# Altium project Base.PrjPCB
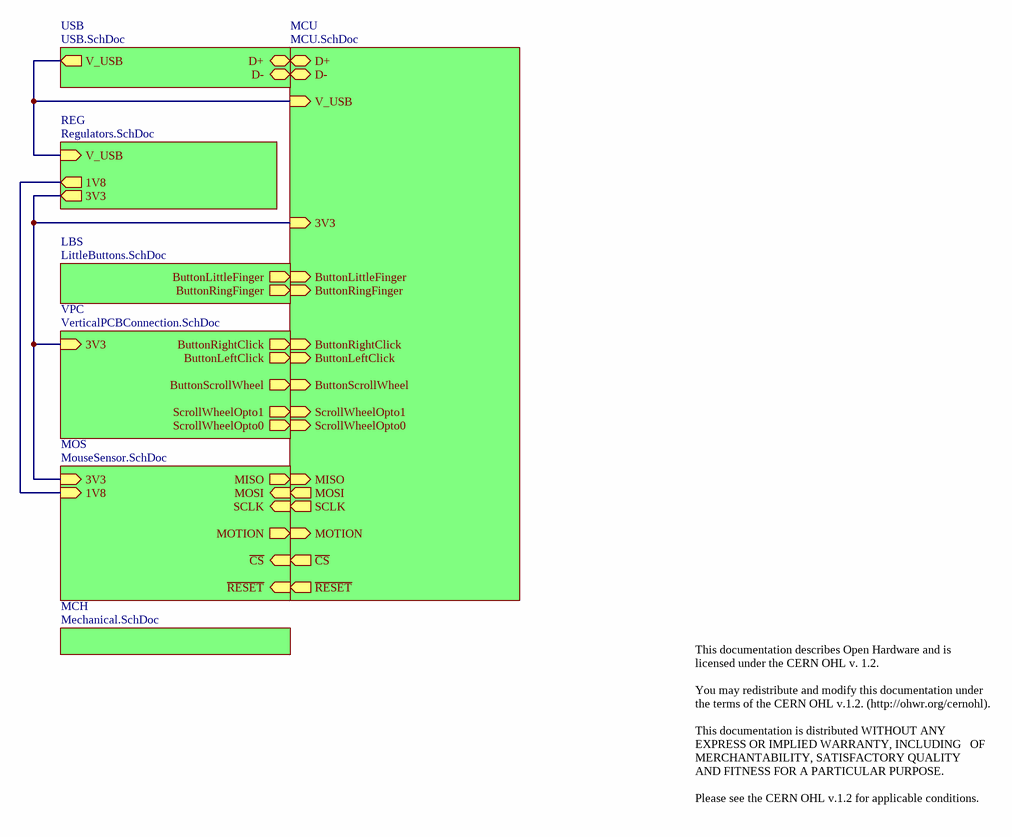
[diagram p0: Base.SchDoc]
8 sheets, 95 parts. Net scope: hierarchical (ports join the sheet entries above them; power ports are global).
Board file: Base.PcbDoc
Sheets:
  Base.SchDoc
    MCU = MCU.SchDoc
    MCH = Mechanical.SchDoc
    REG = Regulators.SchDoc
    VPC = VerticalPCBConnection.SchDoc
    MOS = MouseSensor.SchDoc
    USB = USB.SchDoc
    LBS = LittleButtons.SchDoc

## Sheet Base.SchDoc
size Letter; CompanyName: PloopyCo; Organization: Ploopy Co; Address1: 137-1140 Burnhamthorpe Road W; Address2: Mississauga; Address3: Ontario; Address4: Canada L5C 0A3; DocumentNumber: 1; Revision: R1.004; SheetNumber: 1; SheetTotal: 8

### Sub-sheets
LBS = LittleButtons.SchDoc: ButtonLittleFinger (out), ButtonRingFinger (out)
MCH = Mechanical.SchDoc: no entries
MCU = MCU.SchDoc: 3V3 (in), D+ (bidir), D- (bidir), ButtonRightClick (in), ButtonLeftClick (in), ScrollWheelOpto1 (in), ScrollWheelOpto0 (in), ButtonScrollWheel (in), ButtonLittleFinger (in), ButtonRingFinger (in), ~{CS} (out), MISO (in), MOSI (out), SCLK (out), V_USB (in), ~{RESET} (out), MOTION (in)
MOS = MouseSensor.SchDoc: 1V8 (in), 3V3 (in), ~{CS} (in), MISO (out), MOSI (in), SCLK (in), ~{RESET} (in), MOTION (out)
REG = Regulators.SchDoc: 3V3 (out), V_USB (in), 1V8 (out)
USB = USB.SchDoc: D+ (bidir), V_USB (out), D- (bidir)
VPC = VerticalPCBConnection.SchDoc: 3V3 (in), ButtonRightClick (out), ButtonLeftClick (out), ScrollWheelOpto1 (out), ScrollWheelOpto0 (out), ButtonScrollWheel (out)

### Nets
1V8: sheet REG/1V8, sheet MOS/1V8
3V3: sheet MCU/3V3, sheet REG/3V3, sheet VPC/3V3, sheet MOS/3V3
~{CS}: sheet MCU/~{CS}, sheet MOS/~{CS}
MISO: sheet MCU/MISO, sheet MOS/MISO
MOSI: sheet MCU/MOSI, sheet MOS/MOSI
~{RESET}: sheet MCU/~{RESET}, sheet MOS/~{RESET}
SCLK: sheet MCU/SCLK, sheet MOS/SCLK
V_USB: sheet MCU/V_USB, sheet REG/V_USB, sheet USB/V_USB
NetC20_2: sheet MCU/ButtonRingFinger, sheet LBS/ButtonRingFinger
NetC21_2: sheet MCU/ButtonLittleFinger, sheet LBS/ButtonLittleFinger
NetCJ3_1: sheet MCU/ScrollWheelOpto0, sheet VPC/ScrollWheelOpto0
NetCJ4_1: sheet MCU/ScrollWheelOpto1, sheet VPC/ScrollWheelOpto1
NetR6_2: sheet MCU/D-, sheet USB/D-
NetR7_2: sheet MCU/D+, sheet USB/D+
NetR8_2: sheet MCU/ButtonScrollWheel, sheet VPC/ButtonScrollWheel
NetR9_2: sheet MCU/ButtonLeftClick, sheet VPC/ButtonLeftClick
NetR10_2: sheet MCU/ButtonRightClick, sheet VPC/ButtonRightClick
NetU1_19: sheet MCU/MOTION, sheet MOS/MOTION

### Notes on the sheet
- This documentation describes Open Hardware and is licensed under the CERN OHL v. 1.2.
  You may redistribute and modify this documentation under the terms of the CERN OHL v.1.2. (http://ohwr.org/cernohl).
  This documentation is distributed WITHOUT ANY EXPRESS OR IMPLIED WARRANTY, INCLUDING   OF MERCHANTABILITY, SATISFACTORY QUALITY   AND FITNESS FOR A PARTICULAR PURPOSE.
  Please see the CERN OHL v.1.2 for applicable conditions.
- Copyright Ploopy Corporation 2019
- Licensed under the CERN OHL v. 1.2
- http://ohwr.org/cernohl
- Title:
- PCB:
- Version:
- Ploopy Corporation
- Mississauga ON L5C 0A3
- 137-1140 Burnhamthorpe Road W
- Date:
- Time:
- Sheet
- of
- Canada

## Sheet MCU.SchDoc
size Legal; CompanyName: PloopyCo; Organization: Ploopy Co; Address1: 137-1140 Burnhamthorpe Road W; Address2: Mississauga; Address3: Ontario; Address4: Canada L5C 0A3; DocumentNumber: 3; Revision: R1.004; SheetNumber: 3; SheetTotal: 8
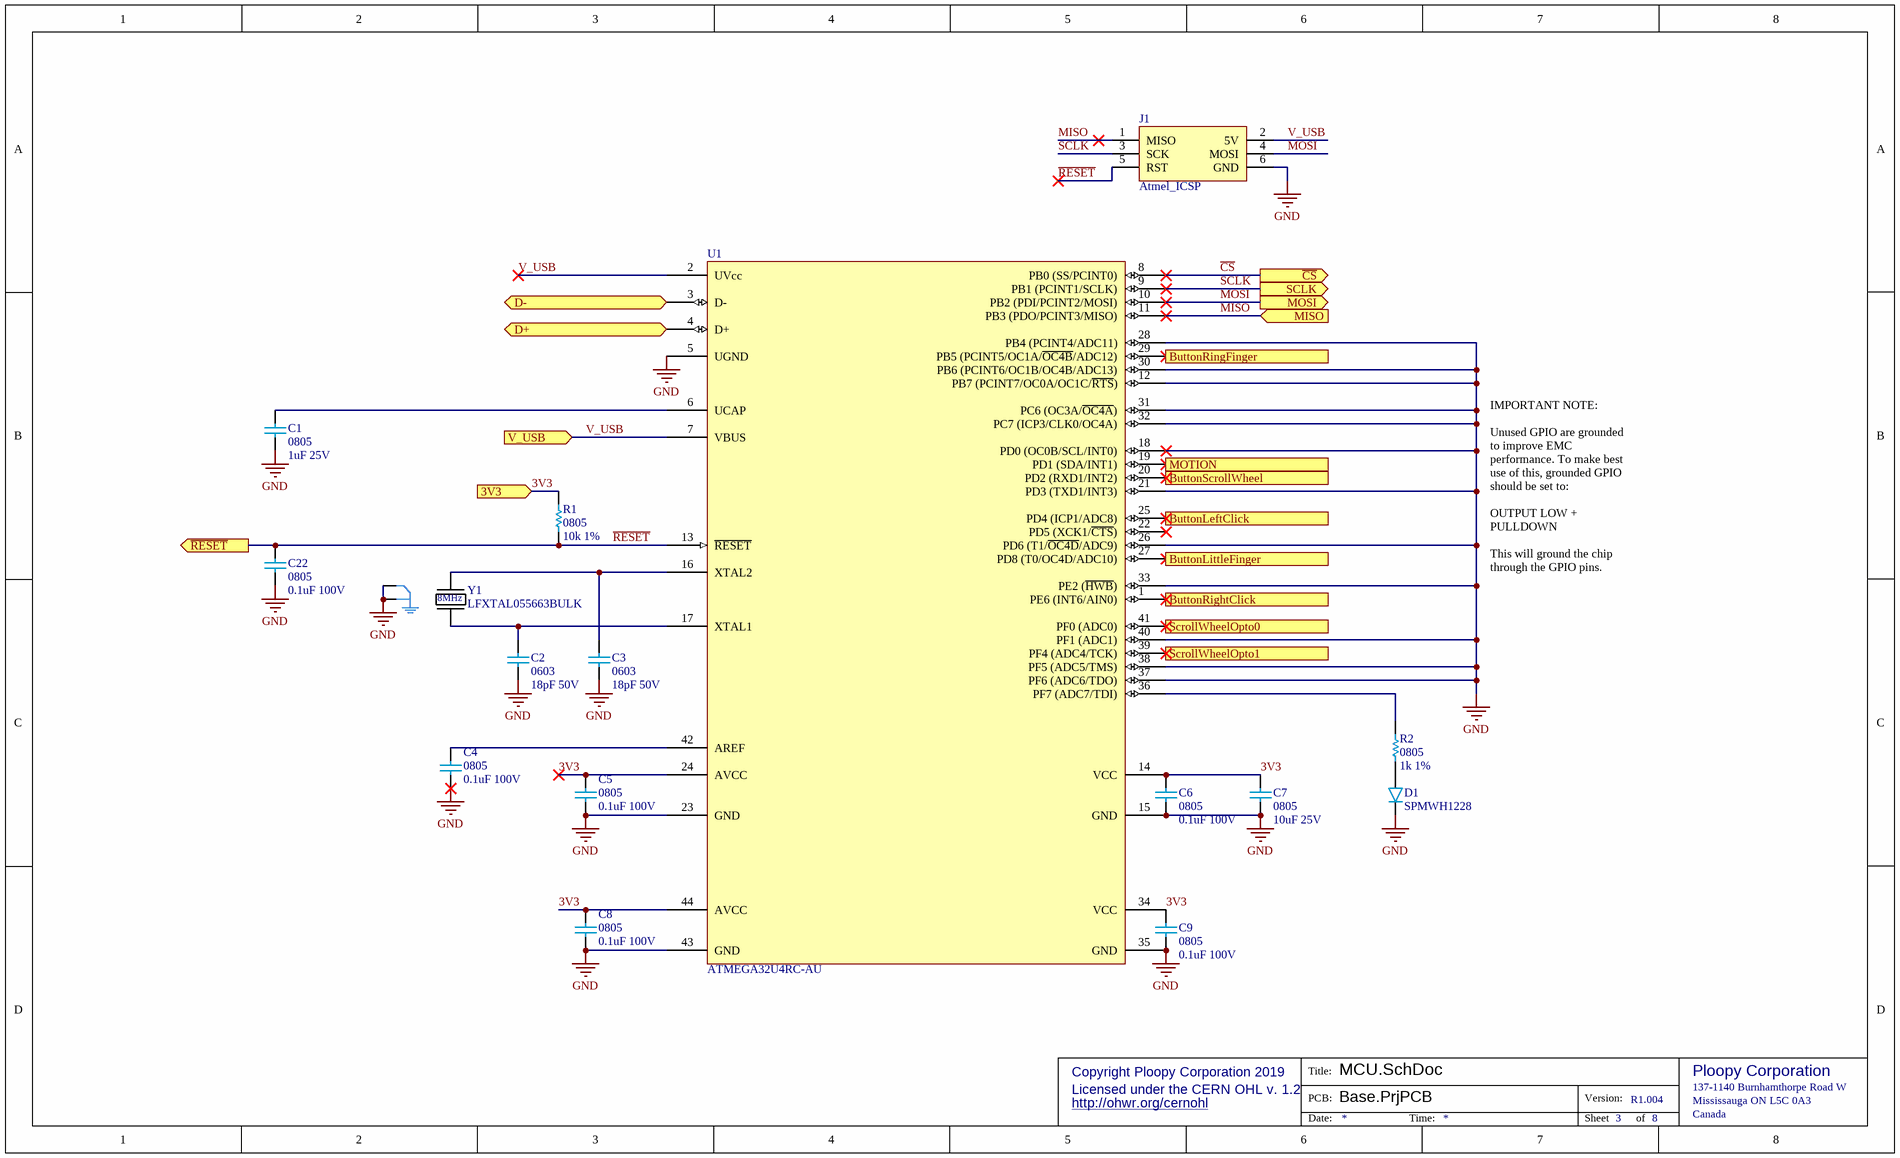
[diagram p1: MCU.SchDoc]

### Parts
C1  0805  value 1uF 25V  [0805]
C2  0603  value 18pF 50V  [0603]
C3  0603  value 18pF 50V  [0603]
C4  0805  value 0.1uF 100V  [0805]
C5  0805  value 0.1uF 100V  [0805]
C6  0805  value 0.1uF 100V  [0805]
C7  0805  value 10uF 25V  [0805]
C8  0805  value 0.1uF 100V  [0805]
C9  0805  value 0.1uF 100V  [0805]
C22  0805  value 0.1uF 100V  [0805]
D1  SPMWH1228  [SPMWH1228]
J1  Atmel_ICSP  [6x2]
R1  0805  value 10k 1%  [0805]
R2  0805  value 1k 1%  [0805]
U1  ATMEGA32U4RC-AU  [ATmega32U4 - TQFP80P1200X1200X120-44N]
Y1  LFXTAL055663BULK  [LFXTAL055663BULK]

### Ports
3V3 (in), ButtonLeftClick (in), ButtonLittleFinger (in), ButtonRightClick (in), ButtonRingFinger (in), ButtonScrollWheel (in), D+ (bidir), D- (bidir), MISO (in), MOSI (out), MOTION (in), SCLK (out), ScrollWheelOpto0 (in), ScrollWheelOpto1 (in), V_USB (in), ~{CS} (out), ~{RESET} (out)

### Nets
GND: C1.1 C2.1 C3.1 C4.1 C5.1 C6.1 C7.1 C8.1 C9.1 C22.1 D1.2(C) J1.6(GND) U1.5(UGND) U1.12(PB7_(PCINT7/OC0A/OC1C/~{RTS})) U1.15(GND) U1.18(PD0_(OC0B/SCL/INT0)) U1.21(PD3_(TXD1/INT3)) U1.23(GND) U1.26(PD6_(T1/~{OC4D}/ADC9)) U1.28(PB4_(PCINT4/ADC11)) U1.30(PB6_(PCINT6/OC1B/OC4B/ADC13)) U1.31(PC6_(OC3A/~{OC4A})) U1.32(PC7_(ICP3/CLK0/OC4A)) U1.33(PE2_(~{HWB})) U1.35(GND) U1.37(PF6_(ADC6/TDO)) U1.38(PF5_(ADC5/TMS)) U1.40(PF1_(ADC1)) U1.43(GND) Y1.2 Y1.4
3V3: C5.2 C6.2 C7.2 C8.2 C9.2 R1.2 U1.14(VCC) U1.24(AVCC) U1.34(VCC) U1.44(AVCC) ; port 3V3
~{CS}: U1.8(PB0_(SS/PCINT0)) ; port ~{CS}
MISO: J1.1(MISO) U1.11(PB3_(PDO/PCINT3/MISO)) ; port MISO
MOSI: J1.4(MOSI) U1.10(PB2_(PDI/PCINT2/MOSI)) ; port MOSI
~{RESET}: C22.2 J1.5(RST) R1.1 U1.13(~{RESET}) ; port ~{RESET}
SCLK: J1.3(SCK) U1.9(PB1_(PCINT1/SCLK)) ; port SCLK
V_USB: J1.2(5V) U1.2(UVcc) U1.7(VBUS) ; port V_USB
NetC1_2: C1.2 U1.6(UCAP)
NetC2_2: C2.2 U1.17(XTAL1) Y1.3
NetC3_2: C3.2 U1.16(XTAL2) Y1.1
NetC4_2: C4.2 U1.42(AREF)
NetC20_2: U1.29(PB5_(PCINT5/OC1A/~{OC4B}/ADC12)) ; port ButtonRingFinger
NetC21_2: U1.27(PD8_(T0/OC4D/ADC10)) ; port ButtonLittleFinger
NetCJ3_1: U1.41(PF0_(ADC0)) ; port ScrollWheelOpto0
NetCJ4_1: U1.39(PF4_(ADC4/TCK)) ; port ScrollWheelOpto1
NetD1_1: D1.1(A) R2.1
NetR2_2: R2.2 U1.36(PF7_(ADC7/TDI))
NetR6_2: U1.3(D-) ; port D-
NetR7_2: U1.4(D+) ; port D+
NetR8_2: U1.20(PD2_(RXD1/INT2)) ; port ButtonScrollWheel
NetR9_2: U1.25(PD4_(ICP1/ADC8)) ; port ButtonLeftClick
NetR10_2: U1.1(PE6_(INT6/AIN0)) ; port ButtonRightClick
NetU1_19: U1.19(PD1_(SDA/INT1)) ; port MOTION

Not connected (* = marked no-connect by the designer): U1 22(PD5_(XCK1/~{CTS}))*

### Notes on the sheet
- IMPORTANT NOTE:
  Unused GPIO are grounded to improve EMC performance. To make best use of this, grounded GPIO should be set to:
  OUTPUT LOW + PULLDOWN
  This will ground the chip through the GPIO pins.
- Copyright Ploopy Corporation 2019
- Licensed under the CERN OHL v. 1.2
- http://ohwr.org/cernohl
- Title:
- PCB:
- Version:
- Ploopy Corporation
- Mississauga ON L5C 0A3
- 137-1140 Burnhamthorpe Road W
- Date:
- Time:
- Sheet
- of
- Canada
- (in symbol LFXTAL055663BULK) 8MHz

### Library data of the parts
C1 = Cap 1uF 25V: 0805, X5R or better; PNP-Nzl: 2; PNP-dx: 0; PNP-Level: 1; PNP-Thk: 1.25; PNP-TS: 70; PNP-Type: chi; PNP-X: 2.00; PNP-FeedType: Tape; PNP-TapeWidth: 8; Supplier 1: Digi-Key; Supplier Part Number 1: 1276-1066-2-ND; Supplier 2: Digi-Key; Supplier Part Number 2: 1276-1066-1-ND; PNP-dy: 0; PNP-Lv: 1; PNP-Pt: 0; PNP-Voff: 0; PNP-W: 0; PNP-Y: 1.25; PNP-A: 0; PNP-PlacePriority: 1; PNP-TapeIndex: 1; PNP-da: 0
C2 C3 = Cap 18pF 50V: 0603, C0G or better; PNP-Nzl: 2; PNP-dx: 0; PNP-X: 2.00; PNP-Y: 1.25; PNP-Thk: 0.60; PNP-Lv: 1; PNP-TS: 70; PNP-Type: chi; PNP-FeedType: Tape; PNP-TapeWidth: 8; PNP-dy: 0; PNP-Pt: 0; PNP-W: 0; PNP-Level: 1; PNP-Voff: 0; PNP-PlacePriority: 1; PNP-A: 0; PNP-TapeIndex: 1; PNP-da: 0; Supplier 1: Digi-Key; Supplier Part Number 1: 1292-1494-1-ND
C4-C6 C8 C9 = Cap 0.1uF 100V: 0805, X5R or better; PNP-Nzl: 2; PNP-dx: 0; PNP-Level: 1; PNP-Thk: 1.05; PNP-TS: 70; PNP-Type: chi; PNP-X: 2.00; PNP-Y: 1.25; PNP-FeedType: Tape; PNP-TapeWidth: 8; Supplier 1: Digi-Key; Supplier Part Number 1: 1276-6840-2-ND; PNP-dy: 0; PNP-Lv: 1; PNP-Pt: 0; PNP-Voff: 0; PNP-W: 0; PNP-A: 0; PNP-PlacePriority: 1; PNP-TapeIndex: 1; PNP-da: 0
C7 = Cap 10uF 25V: 0805, X5R or better; PNP-Nzl: 2; PNP-dx: 0; PNP-X: 2.00; PNP-Y: 1.25; PNP-Lv: 1; PNP-TS: 70; PNP-Type: chi; PNP-FeedType: Tape; PNP-TapeWidth: 8; PNP-dy: 0; PNP-Pt: 0; PNP-W: 0; PNP-Thk: 1.25; PNP-Level: 1; PNP-Voff: 0; PNP-PlacePriority: 1; PNP-A: 0; PNP-TapeIndex: 1; Supplier 1: Mouser; Supplier Part Number 1: 81-GRM21BR61E106KA3L; Supplier 2: Digi-Key; Supplier Part Number 2: 490-5523-1-ND; PNP-da: 0
C22 = Cap 0.1uF 100V: 0805, X5R or better; PNP-Nzl: 2; PNP-dx: 0; PNP-X: 2.00; PNP-Y: 1.25; PNP-Thk: 1.05; PNP-Lv: 1; PNP-TS: 70; PNP-Type: chi; PNP-FeedType: Tape; PNP-TapeWidth: 8; PNP-dy: 0; PNP-Pt: 0; PNP-W: 0; PNP-Level: 1; PNP-Voff: 0; PNP-PlacePriority: 1; PNP-A: 0; PNP-TapeIndex: 1; Supplier 1: Digi-Key; Supplier Part Number 1: 1276-6840-2-ND; PNP-da: 0
D1 = SPMWH1228: 3V/0.5W white LED, 2.8mm x 3.5mm; PNP-Nzl: 3; PNP-dx: 0; PNP-X: 2.8; PNP-Y: 3.2; PNP-A: 90; PNP-Thk: 0.65; PNP-Lv: 1; PNP-TS: 70; PNP-Type: chi; PNP-FeedType: Tape; PNP-TapeWidth: 8; PNP-PlacePriority: 2; PNP-da: 550; PNP-dy: 0; PNP-Pt: 0; PNP-W: 0; PNP-Level: 1; PNP-Voff: 0; PNP-TapeIndex: 1; Supplier 2: Digi-Key; Supplier Part Number 2: 1510-1428-1-ND; Supplier 3: Digi-Key; Supplier Part Number 3: 1510-1429-1-ND; Supplier 1: Arrow
J1 = Atmel_ICSP: 6-pin 0.100" ICSP header; PNP-da: 0; Supplier 1: Digi-Key; Supplier Part Number 1: S2012EC-03-ND
R1 = Res 10k 1% 0805: Chip resistor; PNP-Nzl: 2; PNP-dx: 0; PNP-X: 2.00; PNP-Y: 1.25; PNP-Thk: 0.55; PNP-Lv: 1; PNP-TS: 70; PNP-Type: chi; PNP-FeedType: Tape; PNP-TapeWidth: 8; Supplier 1: Digi-Key; Supplier Part Number 1: RMCF0805FT10K0TR-ND; PNP-dy: 0; PNP-Pt: 0; PNP-W: 0; PNP-Level: 1; PNP-Voff: 0; PNP-PlacePriority: 1; PNP-A: 0; PNP-TapeIndex: 1; PNP-da: 0
R2 = Res 1k 1% 0805: Chip resistor, 1/8W 100PPM; PNP-Nzl: 2; PNP-dx: 0; PNP-X: 2.00; PNP-Y: 1.25; PNP-Thk: 0.55; PNP-Lv: 1; PNP-TS: 70; PNP-Type: chi; PNP-FeedType: Tape; PNP-TapeWidth: 8; Supplier 1: Digi-Key; Supplier Part Number 1: RMCF0805FT1K00TR-ND; PNP-dy: 0; PNP-Pt: 0; PNP-W: 0; PNP-Level: 1; PNP-Voff: 0; PNP-PlacePriority: 1; PNP-A: 0; PNP-TapeIndex: 1; PNP-da: 0
U1 = ATMEGA32U4RC-AU: IC MCU 8BIT 32KB FLASH 44TQFP; PNP-Nzl: 6; PNP-dx: 0; PNP-X: 12; PNP-A: 270; PNP-Pt: 1; PNP-W: 0.1; PNP-Thk: 1.6; PNP-Lv: 126; PNP-TS: 70; PNP-Level: 1.2; PNP-Type: QFP; PNP-FeedType: Tray; PNP-PlacePriority: 3; PNP-dy: 0; PNP-Y: 12; PNP-Voff: 0; PNP-da: 0; Supplier 1: Digi-Key; Supplier 2: Mouser; Supplier 3: Arrow; Supplier Part Number 1: ATMEGA32U4RC-AU-ND; Supplier Part Number 2: 556-ATMEGA32U4RC-AU; Supplier Part Number 3: ATMEGA32U4RC-AU
Y1 = LFXTAL055663BULK: 8MHz ±20ppm Crystal 18pF 150 Ohms 4-SMD, No Lead; PNP-Nzl: 4; PNP-dx: 0; PNP-X: 8; PNP-Y: 4.5; PNP-Thk: 1.8; PNP-Lv: 1; PNP-TS: 70; PNP-Type: tr; PNP-FeedType: Tape; PNP-TapeWidth: 16; PNP-PlacePriority: 3; PNP-TapeIndex: 2; PNP-dy: 0; PNP-A: 0; PNP-Pt: 0; PNP-W: 0; PNP-Level: 1; PNP-Voff: 0; PNP-da: 0; Supplier 1: Digi-Key; Supplier 2: Mouser; Supplier Part Number 1: 1923-1256-ND; Supplier Part Number 2: 449-LFXTAL055663BULK

## Sheet Mechanical.SchDoc
size Letter; CompanyName: PloopyCo; Organization: Ploopy Co; Address1: 137-1140 Burnhamthorpe Road W; Address2: Mississauga; Address3: Ontario; Address4: Canada L5C 0A3; DocumentNumber: 4; Revision: R1.004; SheetNumber: 4; SheetTotal: 8
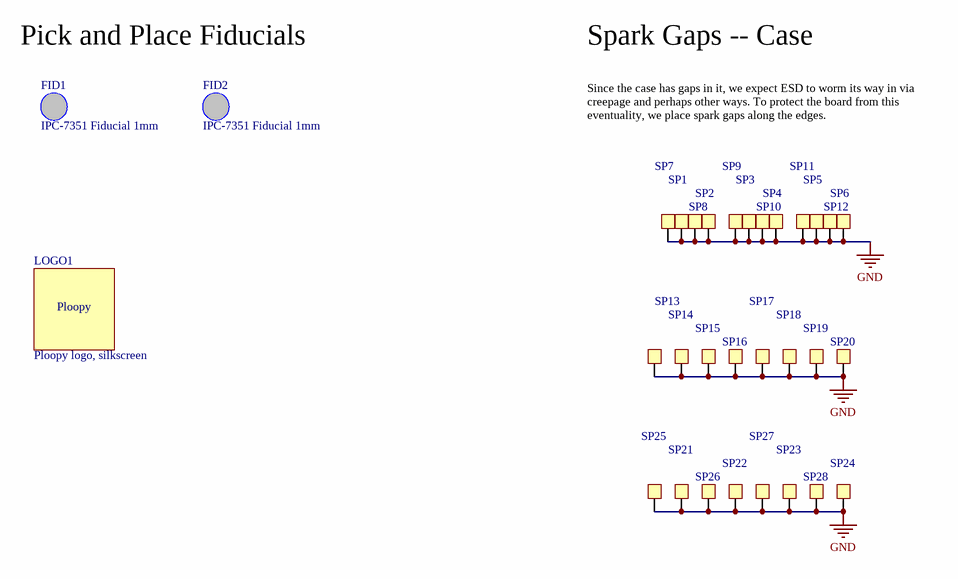
[diagram p2: Mechanical.SchDoc]

### Parts
FID1  IPC-7351 Fiducial 1mm  [FIDUCIAL_1.5]
FID2  IPC-7351 Fiducial 1mm  [FIDUCIAL_1.5]
LOGO1  Ploopy logo, silkscreen  [PloopyLogo]  (no BOM)
SP1  Spark Gap  [SparkGap]  (value not drawn)  (no BOM)
SP2  Spark Gap  [SparkGap]  (value not drawn)  (no BOM)
SP3  Spark Gap  [SparkGap]  (value not drawn)  (no BOM)
SP4  Spark Gap  [SparkGap]  (value not drawn)  (no BOM)
SP5  Spark Gap  [SparkGap]  (value not drawn)  (no BOM)
SP6  Spark Gap  [SparkGap]  (value not drawn)  (no BOM)
SP7  Spark Gap  [SparkGap]  (value not drawn)  (no BOM)
SP8  Spark Gap  [SparkGap]  (value not drawn)  (no BOM)
SP9  Spark Gap  [SparkGap]  (value not drawn)  (no BOM)
SP10  Spark Gap  [SparkGap]  (value not drawn)  (no BOM)
SP11  Spark Gap  [SparkGap]  (value not drawn)  (no BOM)
SP12  Spark Gap  [SparkGap]  (value not drawn)  (no BOM)
SP13  Spark Gap  [SparkGap]  (value not drawn)  (no BOM)
SP14  Spark Gap  [SparkGap]  (value not drawn)  (no BOM)
SP15  Spark Gap  [SparkGap]  (value not drawn)  (no BOM)
SP16  Spark Gap  [SparkGap]  (value not drawn)  (no BOM)
SP17  Spark Gap  [SparkGap]  (value not drawn)  (no BOM)
SP18  Spark Gap  [SparkGap]  (value not drawn)  (no BOM)
SP19  Spark Gap  [SparkGap]  (value not drawn)  (no BOM)
SP20  Spark Gap  [SparkGap]  (value not drawn)  (no BOM)
SP21  Spark Gap  [SparkGap]  (value not drawn)  (no BOM)
SP22  Spark Gap  [SparkGap]  (value not drawn)  (no BOM)
SP23  Spark Gap  [SparkGap]  (value not drawn)  (no BOM)
SP24  Spark Gap  [SparkGap]  (value not drawn)  (no BOM)
SP25  Spark Gap  [SparkGap]  (value not drawn)  (no BOM)
SP26  Spark Gap  [SparkGap]  (value not drawn)  (no BOM)
SP27  Spark Gap  [SparkGap]  (value not drawn)  (no BOM)
SP28  Spark Gap  [SparkGap]  (value not drawn)  (no BOM)

### Nets
GND: SP1.1 SP2.1 SP3.1 SP4.1 SP5.1 SP6.1 SP7.1 SP8.1 SP9.1 SP10.1 SP11.1 SP12.1 SP13.1 SP14.1 SP15.1 SP16.1 SP17.1 SP18.1 SP19.1 SP20.1 SP21.1 SP22.1 SP23.1 SP24.1 SP25.1 SP26.1 SP27.1 SP28.1

Not connected (* = marked no-connect by the designer): FID1 1; FID2 1

### Notes on the sheet
- Pick and Place Fiducials
- Spark Gaps -- Case
- Since the case has gaps in it, we expect ESD to worm its way in via creepage and perhaps other ways. To protect the board from this eventuality, we place spark gaps along the edges.
- Copyright Ploopy Corporation 2019
- Licensed under the CERN OHL v. 1.2
- http://ohwr.org/cernohl
- Title:
- PCB:
- Version:
- Ploopy Corporation
- Mississauga ON L5C 0A3
- 137-1140 Burnhamthorpe Road W
- Date:
- Time:
- Sheet
- of
- Canada
- (in symbol PloopyLogo) Ploopy

### Library data of the parts
FID1 FID2 = FIDUCIAL_1.5: PNP-Nzl: 2; PNP-dx: 0; PNP-X: 4; PNP-A: 1; PNP-Thk: 1.02; PNP-TS: 70; PNP-Type: MARK1; PNP-dy: 0; PNP-Y: 4; PNP-Pt: 0; PNP-W: 0; PNP-Lv: 1; PNP-Level: 1; PNP-Voff: 0; PNP-FeedType: Fiducial; PNP-TapeWidth: 0; PNP-PlacePriority: 0; PNP-TapeIndex: 0; PNP-da: 0
LOGO1 = PloopyLogo: PNP-Nzl: 2; PNP-dx: 0; PNP-X: 1; PNP-TS: 70; PNP-Type: CHI; PNP-FeedType: Tape; PNP-TapeWidth: 8; PNP-dy: 0; PNP-Y: 1; PNP-A: 0; PNP-Pt: 0; PNP-W: 0; PNP-Thk: 1; PNP-Lv: 1; PNP-Level: 1; PNP-Voff: 0; PNP-PlacePriority: 1; PNP-TapeIndex: 1; PNP-da: 0
SP1-SP28 = Spark Gap: Open square pad for spark gapping; PNP-Nzl: 2; PNP-dx: 0; PNP-X: 1; PNP-TS: 70; PNP-Type: CHI; PNP-FeedType: Tape; PNP-TapeWidth: 8; PNP-dy: 0; PNP-Y: 1; PNP-A: 0; PNP-Pt: 0; PNP-W: 0; PNP-Thk: 1; PNP-Lv: 1; PNP-Level: 1; PNP-Voff: 0; PNP-PlacePriority: 1; PNP-TapeIndex: 1; PNP-da: 0

## Sheet Regulators.SchDoc
size Letter; CompanyName: PloopyCo; Organization: Ploopy Co; Address1: 137-1140 Burnhamthorpe Road W; Address2: Mississauga; Address3: Ontario; Address4: Canada L5C 0A3; DocumentNumber: 6; Revision: R1.004; SheetNumber: 6; SheetTotal: 8
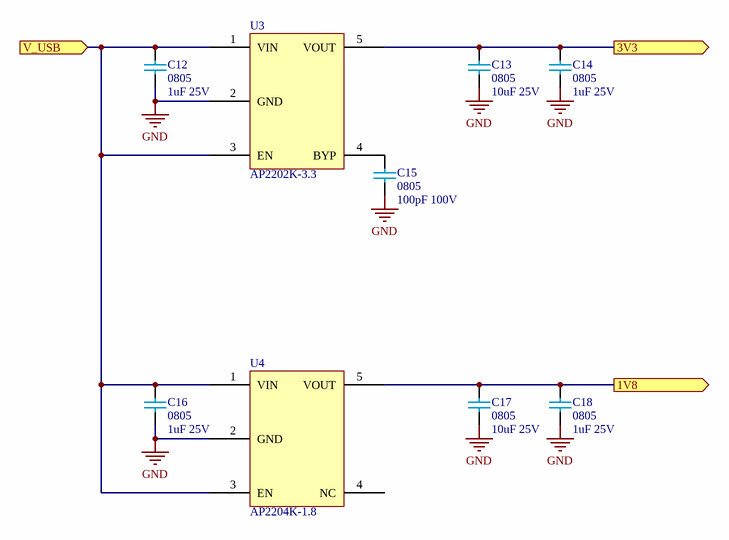
[diagram p3: Regulators.SchDoc]

### Parts
C12  0805  value 1uF 25V  [0805]
C13  0805  value 10uF 25V  [0805]
C14  0805  value 1uF 25V  [0805]
C15  0805  value 100pF 100V  [0805]
C16  0805  value 1uF 25V  [0805]
C17  0805  value 10uF 25V  [0805]
C18  0805  value 1uF 25V  [0805]
U3  AP2202K-3.3  [AP2202 - SOT95P270X145-5N]
U4  AP2204K-1.8  [AP2202 - SOT95P270X145-5N]

### Ports
1V8 (out), 3V3 (out), V_USB (in)

### Nets
GND: C12.1 C13.1 C14.1 C15.1 C16.1 C17.1 C18.1 U3.2(GND) U4.2(GND)
1V8: C17.2 C18.2 U4.5(VOUT) ; port 1V8
3V3: C13.2 C14.2 U3.5(VOUT) ; port 3V3
V_USB: C12.2 C16.2 U3.1(VIN) U3.3(EN) U4.1(VIN) U4.3(EN) ; port V_USB
NetC15_2: C15.2 U3.4(BYP)

Not connected (* = marked no-connect by the designer): U4 4(NC)

### Notes on the sheet
- Copyright Ploopy Corporation 2019
- Licensed under the CERN OHL v. 1.2
- http://ohwr.org/cernohl
- Title:
- PCB:
- Version:
- Ploopy Corporation
- Mississauga ON L5C 0A3
- 137-1140 Burnhamthorpe Road W
- Date:
- Time:
- Sheet
- of
- Canada

### Library data of the parts
C12 C14 C16 C18 = Cap 1uF 25V: as C1 on sheet MCU; Supplier 1: Digi-Key; Supplier Part Number 1: 1276-1066-2-ND; Supplier 2: Digi-Key; Supplier Part Number 2: 1276-1066-1-ND; PNP-dy: 0; PNP-Lv: 1; PNP-Pt: 0; PNP-Voff: 0; PNP-W: 0; PNP-Y: 1.25; PNP-A: 0; PNP-PlacePriority: 1; PNP-TapeIndex: 1; PNP-da: 0
C13 C17 = Cap 10uF 25V: as C7 on sheet MCU; PNP-dy: 0; PNP-Pt: 0; PNP-W: 0; PNP-Thk: 1.25; PNP-Level: 1; PNP-Voff: 0; PNP-PlacePriority: 1; PNP-A: 0; PNP-TapeIndex: 1; Supplier 1: Mouser; Supplier Part Number 1: 81-GRM21BR61E106KA3L; Supplier 2: Digi-Key; Supplier Part Number 2: 490-5523-1-ND; PNP-da: 0
C15 = Cap 100pF 100V: 0805, X5R or better; PNP-Nzl: 2; PNP-dx: 0; PNP-X: 2.00; PNP-Y: 1.25; PNP-Thk: 0.60; PNP-Lv: 1; PNP-TS: 70; PNP-Type: chi; PNP-FeedType: Tape; PNP-TapeWidth: 8; Supplier 1: Digi-Key; Supplier Part Number 1: 1276-2426-1-ND; Supplier 2: Digi-Key; Supplier Part Number 2: 1276-2426-2-ND; PNP-dy: 0; PNP-Pt: 0; PNP-W: 0; PNP-Level: 1; PNP-Voff: 0; PNP-PlacePriority: 1; PNP-A: 0; PNP-TapeIndex: 1; Supplier 3: Arrow; Supplier Part Number 3: L5XIfgkrxsBQF2sGZ85JNyFE59-nywaq7sHwLppiklbTEIlO4Ffw3x4_A6bjf4Mm; PNP-da: 0
U3 = AP2202K-3.3: 3.3V 150mA LDO regulator; PNP-Nzl: 2; PNP-dx: 0; PNP-X: 2.9; PNP-Y: 1.3; PNP-A: 90; PNP-Thk: 1; PNP-Lv: 26; PNP-Type: CHP; PNP-FeedType: Tape; PNP-TapeWidth: 8; PNP-PlacePriority: 3; PNP-dy: 0; PNP-Pt: 0; PNP-W: 0; PNP-TS: 90; PNP-Level: 1; PNP-Voff: 0; PNP-TapeIndex: 1; Supplier 1: Mouser; Supplier Part Number 1: 621-AP2202K-3.3TRG1; Supplier 2: Digi-Key; Supplier Part Number 2: AP2202K-3.3TRG1DICT-ND; Supplier 3: Arrow; Supplier Part Number 3: PWagzdsTFFHKE_U17B45SP-NtndBrheJIaI5hB7gHD0ZVywxIBNyoAQstvnyfZZ0; PNP-da: 0
U4 = AP2204K-1.8: Linear Voltage Regulator IC 1 Output 150mA SOT-23-5; PNP-Nzl: 2; PNP-dx: 0; PNP-X: 2.9; PNP-Y: 1.3; PNP-A: 90; PNP-Thk: 1; PNP-Lv: 26; PNP-Type: CHP; PNP-FeedType: Tape; PNP-TapeWidth: 8; PNP-PlacePriority: 3; PNP-dy: 0; PNP-Pt: 0; PNP-W: 0; PNP-TS: 90; PNP-Level: 1; PNP-Voff: 0; PNP-TapeIndex: 1; PNP-da: 0; Supplier 1: Digi-Key; Supplier 2: Mouser; Supplier Part Number 1: AP2204K-1.8TRG1DICT-ND; Supplier Part Number 2: 621-AP2204K-1.8TRG1

## Sheet VerticalPCBConnection.SchDoc
size Letter; CompanyName: PloopyCo; Organization: Ploopy Co; Address1: 137-1140 Burnhamthorpe Road W; Address2: Mississauga; Address3: Ontario; Address4: Canada L5C 0A3; DocumentNumber: 8; Revision: R1.004; SheetNumber: 8; SheetTotal: 8
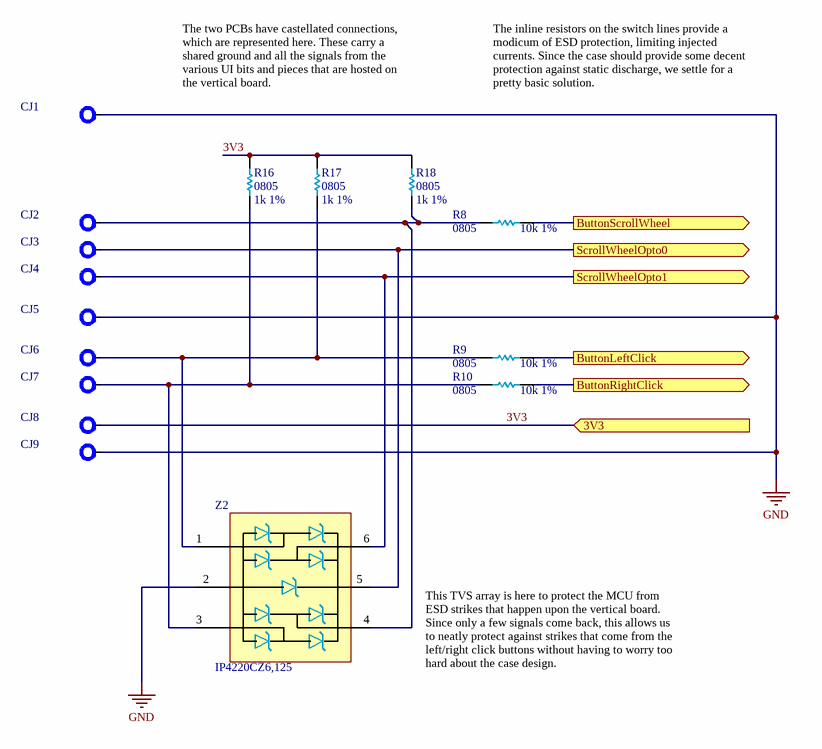
[diagram p4: VerticalPCBConnection.SchDoc]

### Parts
CJ1  PCBJointCastellationJoint  [PCBJoint]  (value not drawn)  (no BOM)
CJ2  PCBJointCastellationJoint  [PCBJoint]  (value not drawn)  (no BOM)
CJ3  PCBJointCastellationJoint  [PCBJoint]  (value not drawn)  (no BOM)
CJ4  PCBJointCastellationJoint  [PCBJoint]  (value not drawn)  (no BOM)
CJ5  PCBJointCastellationJoint  [PCBJoint]  (value not drawn)  (no BOM)
CJ6  PCBJointCastellationJoint  [PCBJoint]  (value not drawn)  (no BOM)
CJ7  PCBJointCastellationJoint  [PCBJoint]  (value not drawn)  (no BOM)
CJ8  PCBJointCastellationJoint  [PCBJoint]  (value not drawn)  (no BOM)
CJ9  PCBJointCastellationJoint  [PCBJoint]  (value not drawn)  (no BOM)
R8  0805  value 10k 1%  [0805]
R9  0805  value 10k 1%  [0805]
R10  0805  value 10k 1%  [0805]
R16  0805  value 1k 1%  [0805]
R17  0805  value 1k 1%  [0805]
R18  0805  value 1k 1%  [0805]
Z2  IP4220CZ6,125  [PESD3V3S4UD - SOT95P275X110-6N]

### Ports
3V3 (in), ButtonLeftClick (out), ButtonRightClick (out), ButtonScrollWheel (out), ScrollWheelOpto0 (out), ScrollWheelOpto1 (out)

### Nets
GND: CJ1.1 CJ5.1 CJ9.1 Z2.2
3V3: CJ8.1 R16.2 R17.2 R18.2 ; port 3V3
NetCJ2_1: CJ2.1 R8.1 R18.1 Z2.4
NetCJ3_1: CJ3.1 Z2.5 ; port ScrollWheelOpto0
NetCJ4_1: CJ4.1 Z2.6 ; port ScrollWheelOpto1
NetCJ6_1: CJ6.1 R9.1 R17.1 Z2.1
NetCJ7_1: CJ7.1 R10.1 R16.1 Z2.3
NetR8_2: R8.2 ; port ButtonScrollWheel
NetR9_2: R9.2 ; port ButtonLeftClick
NetR10_2: R10.2 ; port ButtonRightClick

### Notes on the sheet
- The two PCBs have castellated connections, which are represented here. These carry a shared ground and all the signals from the various UI bits and pieces that are hosted on the vertical board.
- The inline resistors on the switch lines provide a modicum of ESD protection, limiting injected currents. Since the case should provide some decent protection against static discharge, we settle for a pretty basic solution.
- This TVS array is here to protect the MCU from ESD strikes that happen upon the vertical board. Since only a few signals come back, this allows us to neatly protect against strikes that come from the left/right click buttons without having to worry too hard about the case design.
- Copyright Ploopy Corporation 2019
- Licensed under the CERN OHL v. 1.2
- http://ohwr.org/cernohl
- Title:
- PCB:
- Version:
- Ploopy Corporation
- Mississauga ON L5C 0A3
- 137-1140 Burnhamthorpe Road W
- Date:
- Time:
- Sheet
- of
- Canada

### Library data of the parts
CJ1-CJ9 = PCBJoint: Pad for soldering a castellated PCB edge. Easy way to join two PCBs together.; PNP-Nzl: 2; PNP-dx: 0; PNP-X: 1; PNP-TS: 70; PNP-Type: CHI; PNP-FeedType: Tape; PNP-TapeWidth: 8; PNP-dy: 0; PNP-Y: 1; PNP-A: 0; PNP-Pt: 0; PNP-W: 0; PNP-Thk: 1; PNP-Lv: 1; PNP-Level: 1; PNP-Voff: 0; PNP-PlacePriority: 1; PNP-TapeIndex: 1; PNP-da: 0
R8-R10 = Res 10k 1% 0805: as R1 on sheet MCU; Supplier 1: Digi-Key; Supplier Part Number 1: RMCF0805FT10K0TR-ND; PNP-dy: 0; PNP-Pt: 0; PNP-W: 0; PNP-Level: 1; PNP-Voff: 0; PNP-PlacePriority: 1; PNP-A: 0; PNP-TapeIndex: 1; PNP-da: 0
R16-R18 = Res 1k 1% 0805: as R2 on sheet MCU; Supplier 1: Digi-Key; Supplier Part Number 1: RMCF0805FT1K00TR-ND; PNP-dy: 0; PNP-Pt: 0; PNP-W: 0; PNP-Level: 1; PNP-Voff: 0; PNP-PlacePriority: 1; PNP-A: 0; PNP-TapeIndex: 1; PNP-da: 0
Z2 = IP4220CZ6,125: TVS DIODE 5.5V 6TSOP (Low capacitance, USB); PNP-Nzl: 2; PNP-dx: 0; PNP-X: 2.9; PNP-Y: 1.3; PNP-A: 270; PNP-Thk: 1; PNP-Lv: 26; PNP-TS: 90; PNP-Type: CHP; PNP-FeedType: Tape; PNP-TapeWidth: 8; PNP-PlacePriority: 3; PNP-dy: 0; PNP-Pt: 0; PNP-W: 0; PNP-Level: 1; PNP-Voff: 0; PNP-TapeIndex: 1; PNP-da: 0; Supplier 1: Digi-Key; Supplier 2: Mouser; Supplier 3: Arrow; Supplier Part Number 1: 1727-3578-1-ND; Supplier Part Number 2: 771-IP4220CZ6-T/R; Supplier Part Number 3: IP4220CZ6,125

## Sheet MouseSensor.SchDoc
size Letter; CompanyName: PloopyCo; Organization: Ploopy Co; Address1: 137-1140 Burnhamthorpe Road W; Address2: Mississauga; Address3: Ontario; Address4: Canada L5C 0A3; DocumentNumber: 5; Revision: R1.004; SheetNumber: 5; SheetTotal: 8
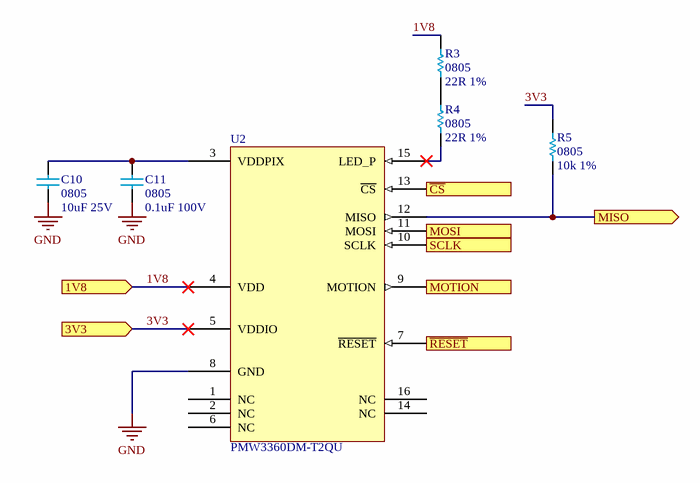
[diagram p5: MouseSensor.SchDoc]

### Parts
C10  0805  value 10uF 25V  [0805]
C11  0805  value 0.1uF 100V  [0805]
R3  0805  value 22R 1%  [0805]
R4  0805  value 22R 1%  [0805]
R5  0805  value 10k 1%  [0805]
U2  PMW3360DM-T2QU  [PMW3360DM-T2QU]

### Ports
1V8 (in), 3V3 (in), MISO (out), MOSI (in), MOTION (out), SCLK (in), ~{CS} (in), ~{RESET} (in)

### Nets
GND: C10.1 C11.1 U2.8(GND)
1V8: R3.2 U2.4(VDD) ; port 1V8
3V3: R5.2 U2.5(VDDIO) ; port 3V3
~{CS}: U2.13(~{CS}) ; port ~{CS}
MISO: R5.1 U2.12(MISO) ; port MISO
MOSI: U2.11(MOSI) ; port MOSI
~{RESET}: U2.7(~{RESET}) ; port ~{RESET}
SCLK: U2.10(SCLK) ; port SCLK
NetC10_2: C10.2 C11.2 U2.3(VDDPIX)
NetR3_1: R3.1 R4.2
NetR4_1: R4.1 U2.15(LED_P)
NetU1_19: U2.9(MOTION) ; port MOTION

Not connected (* = marked no-connect by the designer): U2 1(NC) 2(NC) 6(NC) 14(NC) 16(NC)

### Notes on the sheet
- Copyright Ploopy Corporation 2019
- Licensed under the CERN OHL v. 1.2
- http://ohwr.org/cernohl
- Title:
- PCB:
- Version:
- Ploopy Corporation
- Mississauga ON L5C 0A3
- 137-1140 Burnhamthorpe Road W
- Date:
- Time:
- Sheet
- of
- Canada

### Library data of the parts
C10 = Cap 10uF 25V: as C7 on sheet MCU; PNP-dy: 0; PNP-Pt: 0; PNP-W: 0; PNP-Thk: 1.25; PNP-Level: 1; PNP-Voff: 0; PNP-PlacePriority: 1; PNP-A: 0; PNP-TapeIndex: 1; Supplier 1: Mouser; Supplier Part Number 1: 81-GRM21BR61E106KA3L; Supplier 2: Digi-Key; Supplier Part Number 2: 490-5523-1-ND; PNP-da: 0
C11 = Cap 0.1uF 100V: as C4 on sheet MCU; Supplier 1: Digi-Key; Supplier Part Number 1: 1276-6840-2-ND; PNP-dy: 0; PNP-Lv: 1; PNP-Pt: 0; PNP-Voff: 0; PNP-W: 0; PNP-A: 0; PNP-PlacePriority: 1; PNP-TapeIndex: 1; PNP-da: 0
R3 R4 = Res 22R 1% 0805: Chip resistor; PNP-Nzl: 2; PNP-dx: 0; PNP-X: 2.00; PNP-Y: 1.25; PNP-Thk: 0.55; PNP-Lv: 1; PNP-TS: 70; PNP-Type: chi; PNP-FeedType: Tape; PNP-TapeWidth: 8; PNP-dy: 0; PNP-Pt: 0; PNP-W: 0; PNP-Level: 1; PNP-Voff: 0; PNP-PlacePriority: 1; PNP-A: 0; PNP-TapeIndex: 1; PNP-da: 0; Supplier 1: Digi-Key; Supplier 2: Arrow; Supplier Part Number 1: RMCF0805FT22R0CT-ND; Supplier Part Number 2: RMCF0805FT22R0
R5 = Res 10k 1% 0805: as R1 on sheet MCU; Supplier 1: Digi-Key; Supplier Part Number 1: RMCF0805FT10K0TR-ND; PNP-dy: 0; PNP-Pt: 0; PNP-W: 0; PNP-Level: 1; PNP-Voff: 0; PNP-PlacePriority: 1; PNP-A: 0; PNP-TapeIndex: 1; PNP-da: 0
U2 = PMW3360DM-T2QU: Optical Gaming Navigation Sensor; PNP-Nzl: 4; PNP-dx: 0; PNP-X: 4.9; PNP-Y: 3.9; PNP-W: 0.1; PNP-Thk: 1.45; PNP-Lv: 26; PNP-TS: 70; PNP-Level: 1.3; PNP-Type: QFP; PNP-FeedType: Tape; PNP-TapeWidth: 12; PNP-PlacePriority: 3; PNP-TapeIndex: 2; PNP-dy: 0; PNP-A: 0; PNP-Pt: 0; PNP-Voff: 0; PNP-da: 0

## Sheet USB.SchDoc
size Letter; CompanyName: PloopyCo; Organization: Ploopy Co; Address1: 137-1140 Burnhamthorpe Road W; Address2: Mississauga; Address3: Ontario; Address4: Canada L5C 0A3; DocumentNumber: 7; Revision: R1.004; SheetNumber: 7; SheetTotal: 8
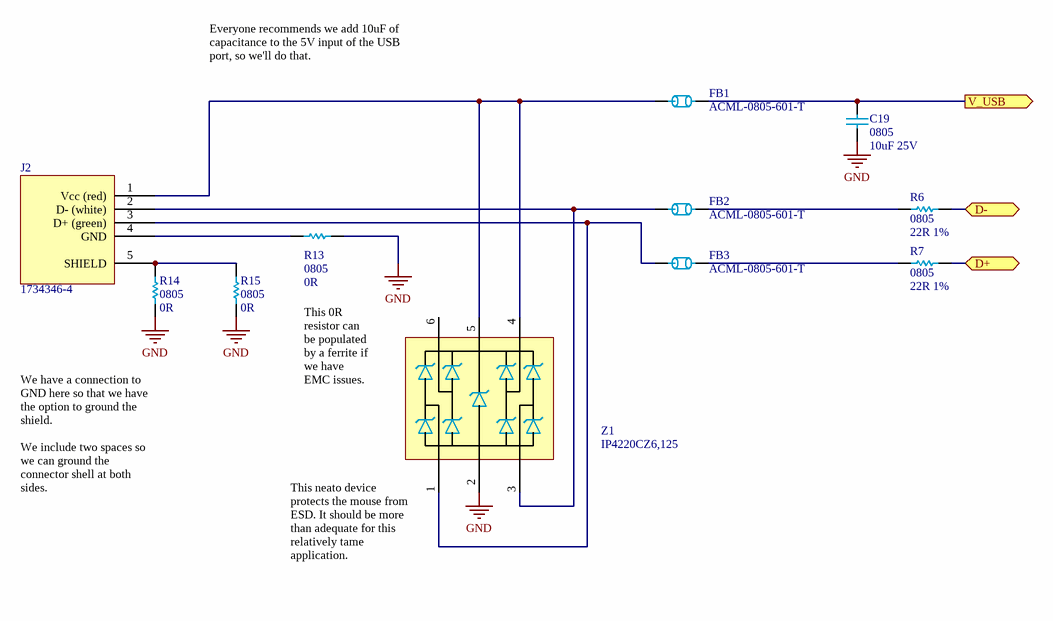
[diagram p6: USB.SchDoc]

### Parts
C19  0805  value 10uF 25V  [0805]
FB1  ACML-0805-601-T  [0805]
FB2  ACML-0805-601-T  [0805]
FB3  ACML-0805-601-T  [0805]
J2  1734346-4  [1734346-4]
R6  0805  value 22R 1%  [0805]
R7  0805  value 22R 1%  [0805]
R13  0805  value 0R  [0805]
R14  0805  value 0R  [0805]
R15  0805  value 0R  [0805]
Z1  IP4220CZ6,125  [PESD3V3S4UD - SOT95P275X110-6N]

### Ports
D+ (bidir), D- (bidir), V_USB (out)

### Nets
GND: C19.1 R13.1 R14.1 R15.1 Z1.2
V_USB: C19.2 FB1.2 ; port V_USB
NetFB1_1: FB1.1 J2.1(Vcc_(red)) Z1.4 Z1.5
NetFB2_1: FB2.1 J2.2(D-_(white)) Z1.3
NetFB2_2: FB2.2 R6.1
NetFB3_1: FB3.1 J2.3(D+_(green)) Z1.1
NetFB3_2: FB3.2 R7.1
NetJ2_4: J2.4(GND) R13.2
NetJ2_5: J2.5(SHIELD) R14.2 R15.2
NetR6_2: R6.2 ; port D-
NetR7_2: R7.2 ; port D+

Not connected (* = marked no-connect by the designer): Z1 6

### Notes on the sheet
- Everyone recommends we add 10uF of capacitance to the 5V input of the USB port, so we'll do that.
- This 0R resistor can be populated by a ferrite if we have EMC issues.
- We have a connection to GND here so that we have the option to ground the shield.
  We include two spaces so we can ground the connector shell at both sides.
- (near Z1) This neato device protects the mouse from ESD. It should be more than adequate for this relatively tame application.
- Copyright Ploopy Corporation 2019
- Licensed under the CERN OHL v. 1.2
- http://ohwr.org/cernohl
- Title:
- PCB:
- Version:
- Ploopy Corporation
- Mississauga ON L5C 0A3
- 137-1140 Burnhamthorpe Road W
- Date:
- Time:
- Sheet
- of
- Canada

### Library data of the parts
C19 = Cap 10uF 25V: as C7 on sheet MCU; PNP-dy: 0; PNP-Pt: 0; PNP-W: 0; PNP-Thk: 1.25; PNP-Level: 1; PNP-Voff: 0; PNP-PlacePriority: 1; PNP-A: 0; PNP-TapeIndex: 1; Supplier 1: Mouser; Supplier Part Number 1: 81-GRM21BR61E106KA3L; Supplier 2: Digi-Key; Supplier Part Number 2: 490-5523-1-ND; PNP-da: 0
FB1-FB3 = ACML-0805-601-T: FERRITE BEAD 600 OHM 0805 1LN; PNP-Nzl: 2; PNP-dx: 0; PNP-X: 2.00; PNP-Y: 1.25; PNP-Thk: 0.55; PNP-Lv: 1; PNP-TS: 70; PNP-Type: chi; PNP-FeedType: Tape; PNP-TapeWidth: 8; PNP-dy: 0; PNP-Pt: 0; PNP-W: 0; PNP-Level: 1; PNP-Voff: 0; PNP-PlacePriority: 1; PNP-A: 0; PNP-TapeIndex: 1; PNP-da: 0; Supplier 1: Digi-Key; Supplier Part Number 1: 535-12556-1-ND
J2 = 1734346-4: USB - B USB 2.0 Receptacle Connector 4 Position Surface Mount, Right Angle; PNP-A: 0; PNP-da: 0; Supplier 1: Digi-Key; Supplier 2: Mouser; Supplier 3: Arrow; Supplier Part Number 1: A114945-ND; Supplier Part Number 2: 571-1734346-1; Supplier Part Number 3: 1734346-1
R6 R7 = Res 22R 1% 0805: as R3 on sheet MouseSensor; PNP-dy: 0; PNP-Pt: 0; PNP-W: 0; PNP-Level: 1; PNP-Voff: 0; PNP-PlacePriority: 1; PNP-A: 0; PNP-TapeIndex: 1; PNP-da: 0; Supplier 1: Digi-Key; Supplier 2: Arrow; Supplier Part Number 1: RMCF0805FT22R0CT-ND; Supplier Part Number 2: RMCF0805FT22R0
R13-R15 = Res 0R 0805: Chip resistor; PNP-Nzl: 2; PNP-dx: 0; PNP-X: 2.00; PNP-Y: 1.25; PNP-Thk: 0.55; PNP-Lv: 1; PNP-TS: 70; PNP-Type: chi; PNP-FeedType: Tape; PNP-TapeWidth: 8; PNP-dy: 0; PNP-Pt: 0; PNP-W: 0; PNP-Level: 1; PNP-Voff: 0; PNP-PlacePriority: 1; PNP-A: 0; PNP-TapeIndex: 1; Supplier 1: Digi-Key; Supplier Part Number 1: RMCF0805ZT0R00TR-ND; PNP-da: 0
Z1 = IP4220CZ6,125: as Z2 on sheet VerticalPCBConnection; PNP-dy: 0; PNP-Pt: 0; PNP-W: 0; PNP-Level: 1; PNP-Voff: 0; PNP-TapeIndex: 1; PNP-da: 0

## Sheet LittleButtons.SchDoc
size Letter; CompanyName: PloopyCo; Organization: Ploopy Co; Address1: 137-1140 Burnhamthorpe Road W; Address2: Mississauga; Address3: Ontario; Address4: Canada L5C 0A3; DocumentNumber: 2; Revision: R1.004; SheetNumber: 2; SheetTotal: 8
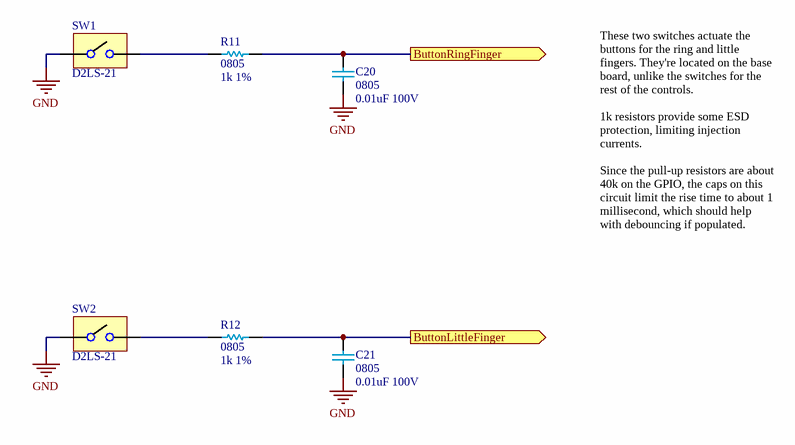
[diagram p7: LittleButtons.SchDoc]

### Parts
C20  0805  value 0.01uF 100V  [0805]
C21  0805  value 0.01uF 100V  [0805]
R11  0805  value 1k 1%  [0805]
R12  0805  value 1k 1%  [0805]
SW1  D2LS-21  [D2LS-21]
SW2  D2LS-21  [D2LS-21]

### Ports
ButtonLittleFinger (out), ButtonRingFinger (out)

### Nets
GND: C20.1 C21.1 SW1.A SW2.A
NetC20_2: C20.2 R11.2 ; port ButtonRingFinger
NetC21_2: C21.2 R12.2 ; port ButtonLittleFinger
NetR11_1: R11.1 SW1.B
NetR12_1: R12.1 SW2.B

### Notes on the sheet
- These two switches actuate the buttons for the ring and little fingers. They're located on the base board, unlike the switches for the rest of the controls.
  1k resistors provide some ESD protection, limiting injection currents.
  Since the pull-up resistors are about 40k on the GPIO, the caps on this circuit limit the rise time to about 1 millisecond, which should help with debouncing if populated.
- Copyright Ploopy Corporation 2019
- Licensed under the CERN OHL v. 1.2
- http://ohwr.org/cernohl
- Title:
- PCB:
- Version:
- Ploopy Corporation
- Mississauga ON L5C 0A3
- 137-1140 Burnhamthorpe Road W
- Date:
- Time:
- Sheet
- of
- Canada

### Library data of the parts
C20 C21 = Cap 0.01uF 100V: 0805, X5R or better; PNP-Nzl: 2; PNP-dx: 0; PNP-X: 2.00; PNP-Y: 1.25; PNP-Thk: 0.85; PNP-Lv: 1; PNP-TS: 70; PNP-Type: chi; PNP-FeedType: Tape; PNP-TapeWidth: 8; PNP-dy: 0; PNP-Pt: 0; PNP-W: 0; PNP-Level: 1; PNP-Voff: 0; PNP-PlacePriority: 1; PNP-A: 0; PNP-TapeIndex: 1; Supplier 1: Digi-Key; Supplier Part Number 1: 1276-6845-2-ND; Supplier 2: Arrow; Supplier Part Number 2: HFLC7Kmwq4-6R2SVzaQAUvCwxvZH1YjWdj_EBba1ByE; PNP-da: 0
R11 R12 = Res 1k 1% 0805: as R2 on sheet MCU; Supplier 1: Digi-Key; Supplier Part Number 1: RMCF0805FT1K00TR-ND; PNP-dy: 0; PNP-Pt: 0; PNP-W: 0; PNP-Level: 1; PNP-Voff: 0; PNP-PlacePriority: 1; PNP-A: 0; PNP-TapeIndex: 1; PNP-da: 0
SW1 SW2 = D2LS-21: Compact Surface-mounting Switch for long durability; Supplier 1: Digi-Key; Supplier 2: Mouser; Supplier Part Number 1: Z4378CT-ND; Supplier Part Number 2: 653-D2LS-21

## Nets that join several sheets
GND: MCU (31 pins), Mechanical (28 pins), Regulators (9 pins), VerticalPCBConnection (CJ1.1 CJ5.1 CJ9.1 Z2.2), MouseSensor (C10.1 C11.1 U2.8), USB (5 pins), LittleButtons (C20.1 C21.1 SW1.A SW2.A)
1V8: Regulators (C17.2 C18.2 U4.5), MouseSensor (R3.2 U2.4)
3V3: MCU (10 pins), Regulators (C13.2 C14.2 U3.5), VerticalPCBConnection (CJ8.1 R16.2 R17.2 R18.2), MouseSensor (R5.2 U2.5)
~{CS}: MCU (U1.8), MouseSensor (U2.13)
MISO: MCU (J1.1 U1.11), MouseSensor (R5.1 U2.12)
MOSI: MCU (J1.4 U1.10), MouseSensor (U2.11)
NetC20_2: MCU (U1.29), LittleButtons (C20.2 R11.2)
NetC21_2: MCU (U1.27), LittleButtons (C21.2 R12.2)
NetCJ3_1: MCU (U1.41), VerticalPCBConnection (CJ3.1 Z2.5)
NetCJ4_1: MCU (U1.39), VerticalPCBConnection (CJ4.1 Z2.6)
NetR6_2: MCU (U1.3), USB (R6.2)
NetR7_2: MCU (U1.4), USB (R7.2)
NetR8_2: MCU (U1.20), VerticalPCBConnection (R8.2)
NetR9_2: MCU (U1.25), VerticalPCBConnection (R9.2)
NetR10_2: MCU (U1.1), VerticalPCBConnection (R10.2)
NetU1_19: MCU (U1.19), MouseSensor (U2.9)
~{RESET}: MCU (C22.2 J1.5 R1.1 U1.13), MouseSensor (U2.7)
SCLK: MCU (J1.3 U1.9), MouseSensor (U2.10)
V_USB: MCU (J1.2 U1.2 U1.7), Regulators (6 pins), USB (C19.2 FB1.2)

## Assembly variants
BoM: not fitted LBS.C.20 LBS.C.21 MCU.C.2 MCU.C.3